# EasyEDA Pro project ProProject_2.4G Wireless_2024-12-04.epro, schematic 2.4g 无线遥控板
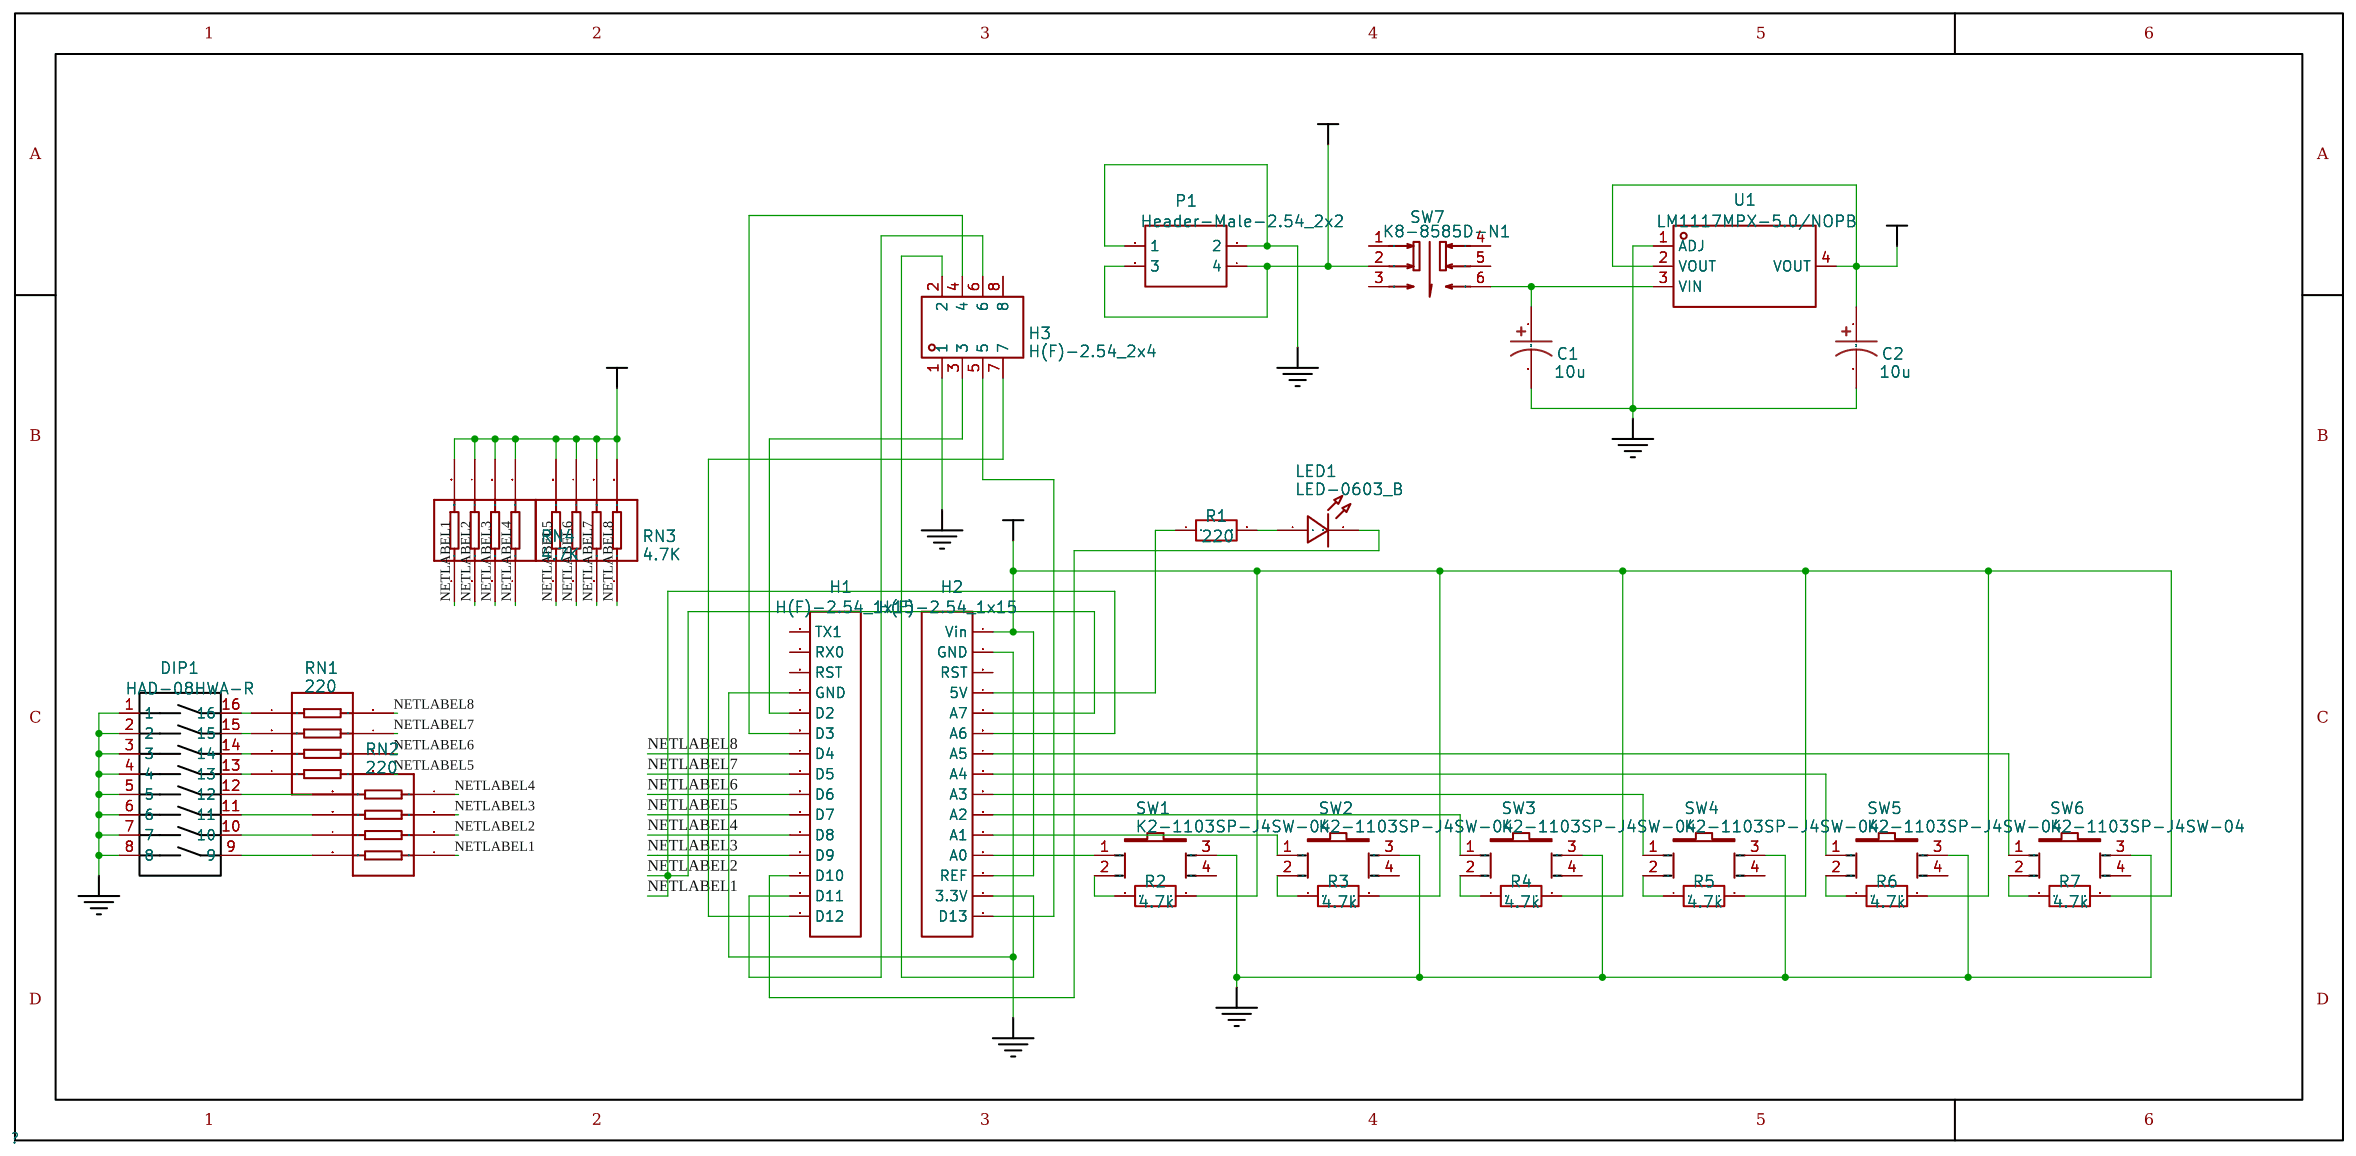
[diagram p1: schematic sheet]

## Parts
C1  10u
C2  10u
DIP1  HAD-08HWA-R
H1  H(F)-2.54_1x15
H2  H(F)-2.54_1x15
H3  H(F)-2.54_2x4
LED1  LED-0603_B
P1  Header-Male-2.54_2x2
R1  220
R2  4.7k
R3  4.7k
R4  4.7k
R5  4.7k
R6  4.7k
R7  4.7k
RN1  220
RN2  220
RN3  4.7K
RN4  4.7K
SW1  K2-1103SP-J4SW-04
SW2  K2-1103SP-J4SW-04
SW3  K2-1103SP-J4SW-04
SW4  K2-1103SP-J4SW-04
SW5  K2-1103SP-J4SW-04
SW6  K2-1103SP-J4SW-04
SW7  K8-8585D-N1
U1  LM1117MPX-5.0/NOPB

## Library data of the parts
C1 C2 = 10u: Supplier Part: C7177; Supplier: LCSC; Manufacturer Part: TAJA106K010RNJ; Manufacturer: AVX; Origin Footprint 2: CASE-A_3216
DIP1 = HAD-08HWA-R: Supplier: LCSC; Manufacturer: ReliaPro; Supplier Part: C4682; Origin Footprint 2: SW-SMD_16P-L21.4-W6.4-P2.54-LS9.8
H1 H2 = H(F)-2.54_1x15: Supplier: LCSC; Manufacturer: Ckmtw; Manufacturer Part: 220S-1*15P H=8.5MM Ytype Gold-plated; Supplier Part: C124408; JLCPCB Part Class: Extended Part; Origin Footprint 2: HDR-TH_15P-P2.54-V
H3 = H(F)-2.54_2x4: Supplier Part: C58378; Supplier: LCSC; Manufacturer: ReliaPro; Manufacturer Part: 2.54mm,2×4Double row female; Origin Footprint 2: HDR-TH_8P-P2.54-V-R2-C4-S2.54
LED1 = LED-0603_B: Manufacturer: EVERLIGHT(台湾亿光); Manufacturer Part: 19-217/BHC-ZL1M2RY/3T; Supplier Part: C72041; Supplier: LCSC; Origin Footprint 2: LED0603_BLUE
P1 = Header-Male-2.54_2x2: Supplier: LCSC; Manufacturer: BOOMELE; Manufacturer Part: Double Rows2.54mm2*2pHeaders  Pins; Supplier Part: C66690; JLCPCB Part Class: Extended Part; Origin Footprint 2: HDR-TH_4P-P2.54-V-R2-C2-S2.54
R1 = 220: Supplier Part: C365116; Supplier: LCSC; Manufacturer Part: HPCR0603F200RK9; Manufacturer: ResistorToday; Origin Footprint 2: R0603
R2-R7 = 4.7k: Supplier Part: C101354; Supplier: LCSC; Manufacturer Part: CR0603JA0472G; Manufacturer: LIZ; Origin Footprint 2: R0603
RN1 RN2 = 220: Supplier: LCSC; Manufacturer: UniOhm; Manufacturer Part: 4D02WGJ0221TCE; Supplier Part: C25498; JLCPCB Part Class: Extended Part; Origin Footprint 2: RES-ARRAY-SMD_0402-8P-L2.0-W1.0-BL
RN3 RN4 = 4.7K: Supplier: LCSC; Manufacturer: UniOhm; Manufacturer Part: 4D02WGJ0472TCE; Supplier Part: C29586; JLCPCB Part Class: Extended Part; Origin Footprint 2: RES-ARRAY-SMD_0402-8P-L2.0-W1.0-BL
SW1-SW6 = K2-1103SP-J4SW-04: Supplier: LCSC; Supplier Part: C223787; Manufacturer: Korean Hroparts Elec; JLCPCB Part Class: Extended Part; Origin Footprint 2: KEY-SMD_4P-L12.0-W12.0-P5.00-LS15.00
SW7 = K8-8585D-N1: Supplier: LCSC; Manufacturer: HRO; Supplier Part: C136689; JLCPCB Part Class: Extended Part; Origin Footprint 2: KEY-TH_6P-L8.5-W8.5-P2.54
U1 = LM1117MPX-5.0/NOPB: Supplier: LCSC; Manufacturer: TI; Supplier Part: C9663; JLCPCB Part Class: Extended Part; Origin Footprint 2: SOT-223-4_L6.5-W3.5-P2.30-LS7.0-BR

## Nets
+5V: C2.1 H2.1(Vin) H2.13(REF) R2.2 R3.2 R4.2 R5.2 R6.2 R7.2 RN3.5 RN3.6 RN3.7 RN3.8 RN4.5 RN4.6 RN4.7 RN4.8 U1.2(VOUT) U1.4(VOUT)
GND: C1.2 C2.2 DIP1.1 DIP1.2 DIP1.3 DIP1.4 DIP1.5 DIP1.6 DIP1.7 DIP1.8 H1.4(GND) H2.2(GND) H3.1 P1.1 P1.2 SW1.3 SW2.3 SW3.3 SW4.3 SW5.3 SW6.3 U1.1(ADJ)
VCC: P1.3 P1.4 SW7.2
NETLABEL1: H2.5(A7) H2.6(A6) RN2.1 RN2.2 RN4.1 RN4.2
NETLABEL3: H1.12(D9) RN2.3 RN4.3
NETLABEL4: H1.11(D8) RN2.4 RN4.4
NETLABEL5: H1.10(D7) RN1.5 RN3.1
NETLABEL6: H1.9(D6) RN1.6 RN3.2
NETLABEL7: H1.8(D5) RN1.7 RN3.3
NETLABEL8: H1.7(D4) RN1.8 RN3.4
Net-(C1-1): C1.1 SW7.6 U1.3(VIN)
Net-(DIP1-9): DIP1.9 RN2.8
Net-(DIP1-10): DIP1.10 RN2.7
Net-(DIP1-11): DIP1.11 RN2.6
Net-(DIP1-12): DIP1.12 RN2.5
Net-(DIP1-13): DIP1.13 RN1.4
Net-(DIP1-14): DIP1.14 RN1.3
Net-(DIP1-15): DIP1.15 RN1.2
Net-(DIP1-16): DIP1.16 RN1.1
Net-(H1-5): H1.5(D2) H3.3
Net-(H1-6): H1.6(D3) H3.4
Net-(H1-13): H1.13(D10) LED1.2
Net-(H1-14): H1.14(D11) H3.6
Net-(H1-15): H1.15(D12) H3.7
Net-(H2-4): H2.4(5V) R1.1
Net-(H2-7): H2.7(A5) SW6.1
Net-(H2-8): H2.8(A4) SW5.1
Net-(H2-9): H2.9(A3) SW4.1
Net-(H2-10): H2.10(A2) SW3.1
Net-(H2-11): H2.11(A1) SW2.1
Net-(H2-12): H2.12(A0) SW1.1
Net-(H2-14): H2.14(3.3V) H3.2
Net-(H2-15): H2.15(D13) H3.5
Net-(LED1-1): LED1.1 R1.2
Net-(R2-1): R2.1 SW1.2
Net-(R3-1): R3.1 SW2.2
Net-(R4-1): R4.1 SW3.2
Net-(R5-1): R5.1 SW4.2
Net-(R6-1): R6.1 SW5.2
Net-(R7-1): R7.1 SW6.2

Not connected (* = marked no-connect by the designer): H1 1(TX1) 2(RX0) 3(RST); H2 3(RST); H3 8; SW1 4; SW2 4; SW3 4; SW4 4; SW5 4; SW6 4; SW7 1 3 4 5
